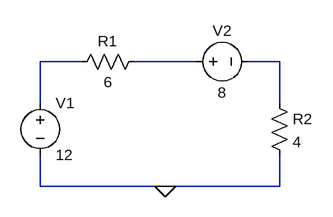
[diagram p0: schematic Draft4.asc]
Draft4.asc, the LTspice schematic file:
Version 4
SHEET 1 880 680
WIRE 160 48 96 48
WIRE 336 48 240 48
WIRE 464 48 416 48
WIRE 96 112 96 48
WIRE 464 112 464 48
WIRE 96 240 96 192
WIRE 288 240 96 240
WIRE 464 240 464 192
WIRE 464 240 288 240
FLAG 288 240 0
SYMBOL voltage 96 96 R0
SYMATTR InstName V1
SYMATTR Value 12
SYMBOL res 256 32 R90
WINDOW 0 0 56 VBottom 2
WINDOW 3 32 56 VTop 2
SYMATTR InstName R1
SYMATTR Value 6
SYMBOL voltage 320 48 R270
WINDOW 0 32 56 VTop 2
WINDOW 3 -32 56 VBottom 2
SYMATTR InstName V2
SYMATTR Value 8
SYMBOL res 448 96 R0
SYMATTR InstName R2
SYMATTR Value 4

The netlist it stands for:
* Draft4.asc
V1 N001 0 12
R1 N002 N001 6
V2 N002 N003 8
R2 N003 0 4
.backanno
.end